# EAGLE board voodoo_dido (EAGLE 7.7.0), part 1 of 2
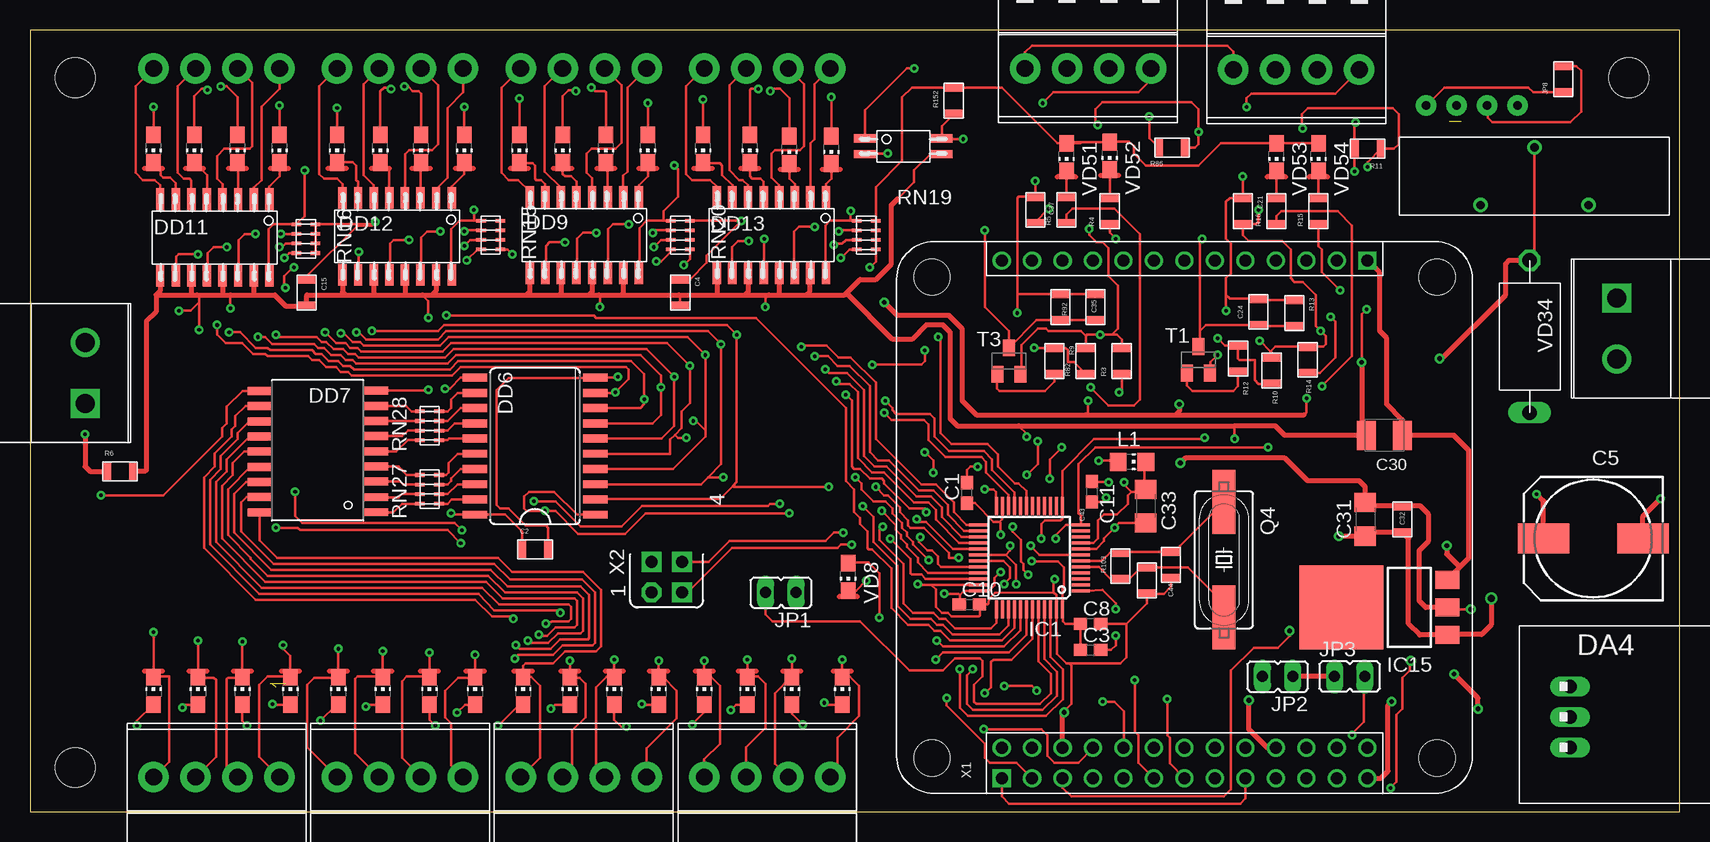
[diagram p2: board, top side]
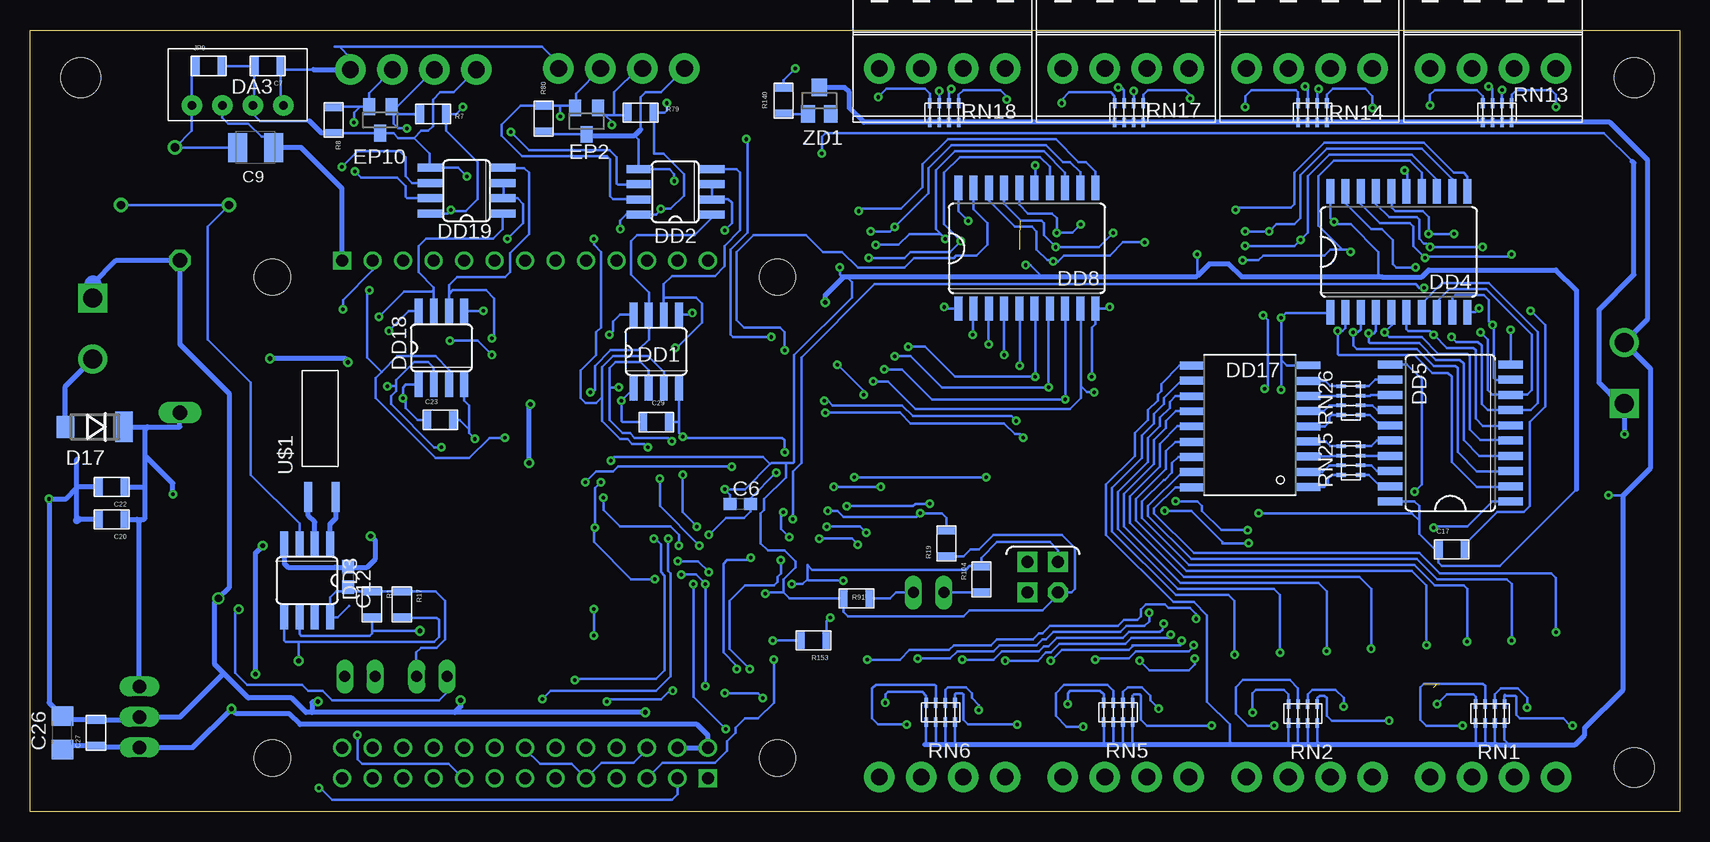
[diagram p3: board, bottom side, seen from below]

Size 137.5 x 65.2 mm. Coordinates in mm from the lower left corner, seen from the top.
Outline: 0,0 137.5,0 137.5,65.2 0,65.2 0,0
Copper layers (1*16): Top 0.035mm / dielectric 1.5mm / Bottom 0.035mm
Design rules "default *": minimum track width 0.22mm, minimum drill 0.29mm, track to track 0.22mm, track to pad 0.22mm, pad to pad 0.22mm, via to via 0.22mm, smd to smd 0.22mm, copper to edge 0.5mm, drill to drill 0.22mm, minimum pad ring 10mil, minimum via ring 8mil, stop-mask expansion 0.1mm, vias tented up to drill 2.5mm, thermal gap 25mil
Net classes: 0 default: width 0.2 mm, drill 0.4 mm, clearance 0.2 mm
Holes 3.3 mm at 133.26,61.23 3.78,61.23 3.78,3.7

## Footprints (pad centres in the part's own frame; a part is rotated, then mirrored left to right if it is on the bottom)
BH840 = drill 0.7: P$1 -4.5,2.4; P$2 0,-2.4; P$3 4.5,2.4
0603MOD = smd 1.1 x 1: 1 -0.85,0; 2 0.85,0
0805MOD = smd 1.6 x 0.7: P$1 0,1.1; P$2 0,-1.1
150CLZ-1010 = smd 4.3 x 2.5: + 4.15,0; - -4.15,0
SMC_B = smd 1.6 x 2.4: + -1.5,0; - 1.5,0
C1206 = smd 1.6 x 1.8: 1 -1.4,0; 2 1.4,0
MLL-41 = smd 1.45 x 1.8: A 2.445,0 | smd 1.45 x 2.54: K -2.445,0
SIP4 = drill 0.7 pad 1.7: 1 -3.81,0; 2 -1.27,0; 3 1.27,0; 4 3.81,0
TO220RAD = drill 1.118 long: 1 -2.34,-4.1; 2 0.2,-4.1; 3 2.74,-4.1
SO08 = smd 0.66 x 2.032: 1 -1.905,-3.073; 2 -0.635,-3.073; 3 0.635,-3.073; 4 1.905,-3.073; 5 1.905,3.073; 6 0.635,3.073; 7 -0.635,3.073; 8 -1.905,3.073
SO20W = smd 0.66 x 2.032: 1 -5.715,-5.029; 2 -4.445,-5.029; 3 -3.175,-5.029; 4 -1.905,-5.029; 5 -0.635,-5.029; 6 0.635,-5.029; 7 1.905,-5.029; 8 3.175,-5.029; 9 4.445,-5.029; 10 5.715,-5.029; 11 5.715,5.029; 12 4.445,5.029; 13 3.175,5.029; 14 1.905,5.029; 15 0.635,5.029; 16 -0.635,5.029; 17 -1.905,5.029; 18 -3.175,5.029; 19 -4.445,5.029; 20 -5.715,5.029
SO18 = smd 0.66 x 2.032: 1 0.69,-1.038; 2 1.94,-1.038; 3 3.24,-1.038; 4 4.49,-1.038; 5 5.74,-1.038; 6 7.04,-1.038; 7 8.29,-1.038; 8 9.54,-1.038; 9 10.84,-1.038; 10 10.81,8.638; 11 9.56,8.638; 12 8.26,8.638; 13 7.01,8.638; 14 5.76,8.638; 15 4.46,8.638; 16 3.21,8.638; 17 1.96,8.638; 18 0.66,8.638
TLP281-4 = smd 0.7 x 1.8: 1 -0.65,-3.4; 2 0.65,-3.4; 3 1.95,-3.4; 4 3.25,-3.4; 5 4.55,-3.4; 6 5.85,-3.4; 7 7.15,-3.4; 8 8.45,-3.4; 9 8.45,3; 10 7.15,3; 11 5.85,3; 12 4.55,3; 13 3.25,3; 14 1.95,3; 15 0.65,3; 16 -0.65,3
SOT23 = smd 1 x 1.4: 1 -0.95,-1.1; 2 0.95,-1.1; 3 0,1.1
TQFP48 = smd 1.5 x 0.25: 1 -4.3,2.75; 2 -4.3,2.25; 3 -4.3,1.75; 4 -4.3,1.25; 5 -4.3,0.75; 6 -4.3,0.25; 7 -4.3,-0.25; 8 -4.3,-0.75; 9 -4.3,-1.25; 10 -4.3,-1.75; 11 -4.3,-2.25; 12 -4.3,-2.75; 25 4.3,-2.75; 26 4.3,-2.25; 27 4.3,-1.75; 28 4.3,-1.25; 29 4.3,-0.75; 30 4.3,-0.25; 31 4.3,0.25; 32 4.3,0.75; 33 4.3,1.25; 34 4.3,1.75; 35 4.3,2.25; 36 4.3,2.75 | smd 0.25 x 1.5: 13 -2.75,-4.3; 14 -2.25,-4.3; 15 -1.75,-4.3; 16 -1.25,-4.3; 17 -0.75,-4.3; 18 -0.25,-4.3; 19 0.25,-4.3; 20 0.75,-4.3; 21 1.25,-4.3; 22 1.75,-4.3; 23 2.25,-4.3; 24 2.75,-4.3; 37 2.75,4.3; 38 2.25,4.3; 39 1.75,4.3; 40 1.25,4.3; 41 0.75,4.3; 42 0.25,4.3; 43 -0.25,4.3; 44 -0.75,4.3; 45 -1.25,4.3; 46 -1.75,4.3; 47 -2.25,4.3; 48 -2.75,4.3
SOT223_PCBRAD = smd 1.5 x 2: 1 -2.3,-3.15; 2 0,-3.15; 3 2.3,-3.15 | smd 7 x 7: 4 0,5.685
JP1 = drill 0.914 long: 1 0,-1.27; 2 0,1.27
1206/0603 = smd 1.5 x 1.4: 1 0,-1.15; 2 0,1.15
TLP281 = smd 0.7 x 1.8: 1 -0.65,-3.2; 2 0.65,-3.2; 3 0.65,3.2; 4 -0.65,3.2
HC49UP = smd 5.334 x 1.93: 1 -4.826,0; 2 4.826,0
CAT16-J4 = smd 0.3 x 0.8: 1 -1.2,-0.8; 2 -0.4,-0.8; 3 0.4,-0.8; 4 1.2,-0.8; 5 1.2,0.8; 6 0.4,0.8; 7 -0.4,0.8; 8 -1.2,0.8
SOT23-BEC = smd 1 x 1.4: B -0.95,-1.1; C 0,1.1; E 0.95,-1.1
KX-38 = smd 2.5 x 0.66: 1 -5.047,-1.27; 2 -5.047,1
CHIP-LED0805 = smd 1.2 x 1.4: A 0,-1.15; C 0,1.15
MSORB_41A-04_D = drill 1.2 octagon: A 0,-6.35 | drill 1.2 long: С 0,6.35
OPI0X = drill 1 square: 1 0,0; 27 30.48,43.18 | drill 1: 2 0,2.54; 3 2.54,0; 4 2.54,2.54; 5 5.08,0; 6 5.08,2.54; 7 7.62,0; 8 7.62,2.54; 9 10.16,0; 10 10.16,2.54; 11 12.7,0; 12 12.7,2.54; 13 15.24,0; 14 15.24,2.54; 15 17.78,0; 16 17.78,2.54; 17 20.32,0; 18 20.32,2.54; 19 22.86,0; 20 22.86,2.54; 21 25.4,0; 22 25.4,2.54; 23 27.94,0; 24 27.94,2.54; 25 30.48,0; 26 30.48,2.54; 28 27.94,43.18; 29 25.4,43.18; 30 22.86,43.18; 31 20.32,43.18; 32 17.78,43.18; 33 15.24,43.18; 34 12.7,43.18; 35 10.16,43.18; 36 7.62,43.18; 37 5.08,43.18; 38 2.54,43.18; 39 0,43.18 | hole 3: -5.815,1.694; 36.295,1.694; 36.295,41.805; -5.815,41.805
PLD04 = drill 1 pad 1.676 octagon: 1 -1.27,1.27 | drill 1 pad 1.676 square: 2 -1.27,-1.27; 3 1.27,1.27; 4 1.27,-1.27
2EDGVC-5.08-02P = drill 1.6 square: 1 -2.54,0 | drill 1.6: 2 2.54,0
15EDGVC-3.5-04P = drill 1.4 pad 2.54: 1 -5,0; 2 -1.5,0; 3 2,0; 4 5.5,0
SOT23' = smd 1.143 x 1.448: 1 -0.95,-1.1; 2 0.95,-1.1 | smd 1.27 x 1.448: 3 0,1.1

## Placement (x,y rotation side)
B1  BH840  [BH840]  125.4,53 180 top
C1  0.1uF  [0603MOD]  78.1,26.6 90 top
C2  0.1uF  [0805MOD]  42.1,21.9 270 top
C3  0.1uF  [0603MOD]  88.4,13.5 0 top
C4  0.1uF  [0805MOD]  54.2,43.3 180 top
C5  1000uF  [150CLZ-1010]  130.3,22.8 180 top
C6  0.1uF  [0603MOD]  78.3,25.7 0 bottom
C7  0.1uF  [0805MOD]  117.7,62.2 90 bottom
C8  0.1uF  [0603MOD]  88.4,15.7 0 top
C9  47uF  [SMC_B]  118.7,55.4 180 bottom
C10  0.1uF  [0603MOD]  78.3,17.3 0 top
C11  0.1uF  [0603MOD]  88.5,26.7 270 top
C12  0.1uF  [0603MOD]  111,19.6 270 bottom
C15  0.1uF  [0805MOD]  23.07,43.3 180 top
C17  0.1uF  [0805MOD]  19,21.9 270 bottom
C20  0.1uF  [0805MOD]  130.7,24.4 90 bottom
C21  0.1uF  [0805MOD]  101.1,50.1 180 top
C22  1uF  [0805MOD]  130.7,27.1 90 bottom
C23  0.1uF  [0805MOD]  103.3,32.7 270 bottom
C24  0.01uF  [0805MOD]  102.4,41.7 0 top
C26  10uF  [C1206]  134.8,6.6 90 bottom
C27  0.1uF  [0805MOD]  132,6.6 0 bottom
C29  0.1uF  [0805MOD]  85.3,32.5 270 bottom
C30  47uF  [SMC_B]  112.9,31.4 180 top
C31  10uF  [C1206]  111.3,24.4 270 top
C32  0.1uF  [0805MOD]  114.4,24.4 0 top
C33  10uF  [C1206]  93,25.5 270 top
C35  0.01uF  [0805MOD]  88.8,42.1 0 top
C37  0.1uF  [0805MOD]  83.8,50.2 180 top
C43  27pF  [0805MOD]  93.1,19.3 0 top
C44  27pF  [0805MOD]  95.1,20.6 0 top
D17  SS14"  [MLL-41]  132.1,32.1 180 bottom
DA3  P6AU-0505ELF  [SIP4]  120.2,58.9 0 bottom
DA4  7805MOD_RAD  [TO220RAD]  132.49,8.12 270 top
DD1  ADUM1201BRZ  [SO08]  85.3,38.4 0 bottom
DD2  SP3485  [SO08]  83.7,51.7 90 bottom
DD3  DS1307  [SO08]  114.4,19.3 180 bottom
DD4  74LVC245A  [SO20W]  23.4,46.7 0 bottom
DD5  74LVC574A  [SO20W]  19.1,31.6 90 bottom
DD6  74LVC574A  [SO20W]  42.1,30.5 90 top
DD7  ULN2803AFWG  [SO18]  27.8,24.3 90 top
DD8  74LVC245A  [SO20W]  54.4,47 0 bottom
DD9  TLP281-4  [TLP281-4]  50.1,47.9 180 top
DD11  TLP281-4  [TLP281-4]  19.3,47.7 180 top
DD12  TLP281-4  [TLP281-4]  34.5,47.8 180 top
DD13  TLP281-4  [TLP281-4]  65.7,47.9 180 top
DD17  ULN2803AFWG  [SO18]  32,26.4 90 bottom
DD18  ADUM1201BRZ  [SO08]  103.2,38.7 0 bottom
DD19  SP3485  [SO08]  101.1,51.8 90 bottom
EP2  ESDA6V1L  [SOT23]  91.1,57.6 180 bottom
EP10  ESDA6V1L  [SOT23]  108.3,57.7 180 bottom
IC1  [TQFP48]  83.3,21.2 180 top
IC15  NCP1117ST33T3G_RAD  [SOT223_PCBRAD]  114.98,17.05 90 top
JP1  [JP1]  62.6,18.3 90 top
JP2  [JP1]  104,11.3 90 top
JP3  [JP1]  110,11.3 270 top
JP8  0R  [0805MOD]  127.8,61.1 0 top
JP9  0R  [0805MOD]  122.6,62.2 270 bottom
L1  BLM21A  [1206/0603]  91.86,29.2 270 top
OK43  TLP281  [TLP281]  72.8,55.5 270 top
Q4  Q8.000MHz/20pF/HC-49SM(SMD)  [HC49UP]  99.52,21.03 270 top
R1  10K  [0805MOD]  109,17.3 180 bottom
R3  10K  [0805MOD]  91,37.6 0 top
R4  470R  [0805MOD]  90,50.1 0 top
R5  470R  [0805MOD]  86.4,50.2 0 top
R6  0R  [0805MOD]  7.5,28.4 270 top
R7  4K7  [0805MOD]  103.9,58.2 270 bottom
R8  4K7  [0805MOD]  112.2,57.7 0 bottom
R9  4K7  [0805MOD]  85.4,37.6 180 top
R10  10K  [0805MOD]  103.5,36.8 0 top
R11  120R  [0805MOD]  111.5,55.3 90 top
R12  4K7  [0805MOD]  100.7,37.8 180 top
R13  10K  [0805MOD]  105.4,41.6 180 top
R14  10K  [0805MOD]  106.5,37.7 0 top
R15  470R  [0805MOD]  107.4,50.1 0 top
R16  470R  [0805MOD]  103.9,50.1 0 top
R17  10K  [0805MOD]  106.5,17.3 180 bottom
R19  10K  [0805MOD]  61.1,22.4 0 bottom
R79  4K7  [0805MOD]  86.6,58.3 270 bottom
R80  4K7  [0805MOD]  94.7,57.8 0 bottom
R82  10K  [0805MOD]  88,37.6 0 top
R86  120R  [0805MOD]  95.2,55.4 90 top
R91  2K2  [0805MOD]  68.6,17.8 270 bottom
R92  10K  [0805MOD]  85.9,42.1 180 top
R103  1M  [0805MOD]  90.9,20.5 0 top
R104  10K  [0805MOD]  58.2,19.4 180 bottom
R140  4K7  [0805MOD]  74.7,59.3 180 bottom
R152  470R  [0805MOD]  77,59.3 0 top
R153  470R  [0805MOD]  72.2,14.3 90 bottom
RN1  2K2  [CAT16-J4]  15.8,8.2 180 bottom
RN2  2K2  [CAT16-J4]  31.4,8.2 180 bottom
RN5  2K2  [CAT16-J4]  46.8,8.3 180 bottom
RN6  2K2  [CAT16-J4]  61.6,8.3 180 bottom
RN13  2K2  [CAT16-J4]  15.2,58.3 180 bottom
RN14  2K2  [CAT16-J4]  30.6,58.3 180 bottom
RN15  2K2  [CAT16-J4]  38.4,48.1 270 top
RN16  2K2  [CAT16-J4]  23,47.8 270 top
RN17  2K2  [CAT16-J4]  45.9,58.3 180 bottom
RN18  2K2  [CAT16-J4]  61.3,58.3 180 bottom
RN19  2K2  [CAT16-J4]  69.7,48.1 270 top
RN20  2K2  [CAT16-J4]  54.2,48.1 270 top
RN25  470R  [CAT16-J4]  27.4,29.3 270 bottom
RN26  470R  [CAT16-J4]  27.4,34.3 270 bottom
RN27  470R  [CAT16-J4]  33.3,26.9 270 top
RN28  470R  [CAT16-J4]  33.3,32.2 270 top
T1  BC807  [SOT23-BEC]  97.4,37.7 0 top
T3  BC807  [SOT23-BEC]  81.6,37.6 0 top
U$1  KX-38/S  [KX-38]  113.3,31.3 90 bottom
VD1  KP-2012EC(RED)  [CHIP-LED0805]  33.3,10.1 0 top
VD2  KP-2012EC(RED)  [CHIP-LED0805]  29.4,10.1 0 top
VD3  KP-2012EC(RED)  [CHIP-LED0805]  25.7,10.1 0 top
VD4  KP-2012EC(RED)  [CHIP-LED0805]  21.7,10.1 0 top
VD5  KP-2012EC(RED)  [CHIP-LED0805]  17.7,10.1 0 top
VD6  KP-2012EC(RED)  [CHIP-LED0805]  14,10.1 0 top
VD7  KP-2012EC(RED)  [CHIP-LED0805]  10.3,10.1 0 top
VD8  KP-2012SGC(GREEN)  [CHIP-LED0805]  68.2,19.6 180 top
VD9  KP-2012SGC(GREEN)  [CHIP-LED0805]  10.3,55.3 180 top
VD10  KP-2012SGC(GREEN)  [CHIP-LED0805]  13.7,55.3 180 top
VD11  KP-2012SGC(GREEN)  [CHIP-LED0805]  17.3,55.3 180 top
VD12  KP-2012SGC(GREEN)  [CHIP-LED0805]  20.8,55.3 180 top
VD13  KP-2012SGC(GREEN)  [CHIP-LED0805]  25.6,55.3 180 top
VD14  KP-2012SGC(GREEN)  [CHIP-LED0805]  29.2,55.3 180 top
VD15  KP-2012SGC(GREEN)  [CHIP-LED0805]  32.6,55.3 180 top
VD16  KP-2012SGC(GREEN)  [CHIP-LED0805]  36.2,55.3 180 top
VD17  KP-2012EC(RED)  [CHIP-LED0805]  67.7,10.1 0 top
VD18  KP-2012SGC(GREEN)  [CHIP-LED0805]  40.8,55.3 180 top
VD19  KP-2012SGC(GREEN)  [CHIP-LED0805]  44.4,55.3 180 top
VD20  KP-2012SGC(GREEN)  [CHIP-LED0805]  48,55.3 180 top
VD21  KP-2012SGC(GREEN)  [CHIP-LED0805]  51.5,55.3 180 top
VD22  KP-2012SGC(GREEN)  [CHIP-LED0805]  56.1,55.3 180 top
VD23  KP-2012EC(RED)  [CHIP-LED0805]  63.5,10.1 0 top
VD24  KP-2012EC(RED)  [CHIP-LED0805]  59.8,10.1 0 top
VD25  KP-2012EC(RED)  [CHIP-LED0805]  56.2,10.1 0 top
VD26  KP-2012EC(RED)  [CHIP-LED0805]  52.4,10.1 0 top
VD27  KP-2012EC(RED)  [CHIP-LED0805]  48.7,10.1 0 top
VD28  KP-2012EC(RED)  [CHIP-LED0805]  45,10.1 0 top
VD29  KP-2012EC(RED)  [CHIP-LED0805]  37.1,10.1 0 top
VD30  KP-2012EC(RED)  [CHIP-LED0805]  41.1,10.1 0 top
VD34  1.5KE15A  [MSORB_41A-04_D]  125.01,39.64 180 top
VD35  KP-2012SGC(GREEN)  [CHIP-LED0805]  60,55.3 180 top
VD36  KP-2012SGC(GREEN)  [CHIP-LED0805]  63.3,55.2 180 top
VD37  KP-2012SGC(GREEN)  [CHIP-LED0805]  66.8,55.2 180 top
VD51  KP-2012SGC(GREEN)  [CHIP-LED0805]  86.4,54.6 180 top
VD52  KP-2012SGC(GREEN)  [CHIP-LED0805]  90,54.7 180 top
VD53  KP-2012SGC(GREEN)  [CHIP-LED0805]  103.9,54.6 180 top
VD54  KP-2012SGC(GREEN)  [CHIP-LED0805]  107.4,54.6 180 top
X1  OPI-ZERO-X  [OPI0X]  81,2.8 0 top
X2  PLD-04  [PLD04]  53.07,19.58 90 top
X3  2EDG_C-5.08-02PVERTICAL  [2EDGVC-5.08-02P]  4.6,36.6 90 top
X4  15EDG_C-3.5-04PVERT  [15EDGVC-3.5-04P]  15.3,2.9 0 top
X5  15EDG_C-3.5-04PVERT  [15EDGVC-3.5-04P]  30.6,2.9 0 top
X6  15EDG_C-3.5-04PVERT  [15EDGVC-3.5-04P]  45.9,2.9 0 top
X7  15EDG_C-3.5-04PVERT  [15EDGVC-3.5-04P]  61.2,2.9 0 top
X8  15EDG_C-3.5-04PVERT  [15EDGVC-3.5-04P]  15.3,62 180 bottom
X9  15EDG_C-3.5-04PVERT  [15EDGVC-3.5-04P]  30.6,62 180 bottom
X10  15EDG_C-3.5-04PVERT  [15EDGVC-3.5-04P]  45.9,62 180 bottom
X11  15EDG_C-3.5-04PVERT  [15EDGVC-3.5-04P]  61.2,62 180 bottom
X18  2EDG_C-5.08-02PVERTICAL  [2EDGVC-5.08-02P]  132.27,40.3 270 top
X19  15EDG_C-3.5-04PVERT  [15EDGVC-3.5-04P]  88.44,61.99 180 top
X20  15EDG_C-3.5-04PVERT  [15EDGVC-3.5-04P]  105.8,61.9 180 top
ZD1  BZX84-C12  [SOT23']  71.7,59.3 0 bottom